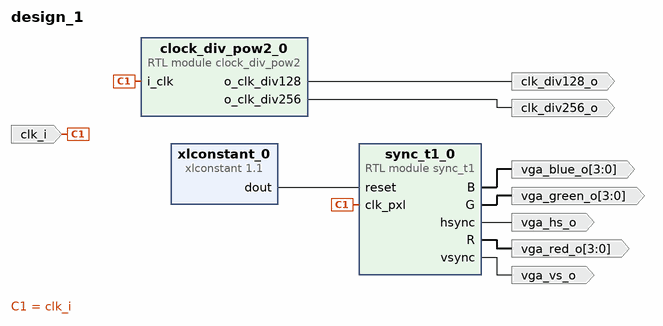
[diagram p0: block diagram of the top level]
# Vivado block design design_1, xc7a100tcsg324-1, Vivado 2019.2
create_bd_design design_1

create_bd_port -dir I -type clk clk_i
set_property -dict {CONFIG.FREQ_HZ 100000000} [get_bd_ports clk_i]
create_bd_port -dir O clk_div256_o
create_bd_port -dir O clk_div128_o
create_bd_port -dir O -from 3 -to 0 vga_red_o
create_bd_port -dir O -from 3 -to 0 vga_green_o
create_bd_port -dir O -from 3 -to 0 vga_blue_o
create_bd_port -dir O vga_hs_o
create_bd_port -dir O vga_vs_o

create_bd_cell -type module -reference sync_t1 sync_t1_0
create_bd_cell -type module -reference clock_div_pow2 clock_div_pow2_0
create_bd_cell -type ip -vlnv xilinx.com:ip:xlconstant:1.1 xlconstant_0
set_property -dict {CONFIG.CONST_VAL 0} [get_bd_cells xlconstant_0]

# ---- connections ----

connect_bd_net -net genClkRst_0_oclk [get_bd_ports clk_i] [get_bd_pins clock_div_pow2_0/i_clk] [get_bd_pins sync_t1_0/clk_pxl]
connect_bd_net [get_bd_pins xlconstant_0/dout] [get_bd_pins sync_t1_0/reset]
connect_bd_net [get_bd_pins clock_div_pow2_0/o_clk_div256] [get_bd_ports clk_div256_o]
connect_bd_net [get_bd_pins clock_div_pow2_0/o_clk_div128] [get_bd_ports clk_div128_o]
connect_bd_net [get_bd_pins sync_t1_0/R] [get_bd_ports vga_red_o]
connect_bd_net [get_bd_pins sync_t1_0/G] [get_bd_ports vga_green_o]
connect_bd_net [get_bd_pins sync_t1_0/B] [get_bd_ports vga_blue_o]
connect_bd_net [get_bd_pins sync_t1_0/hsync] [get_bd_ports vga_hs_o]
connect_bd_net [get_bd_pins sync_t1_0/vsync] [get_bd_ports vga_vs_o]

validate_bd_design
save_bd_design
